# Altium project main board_Project.PrjPCB
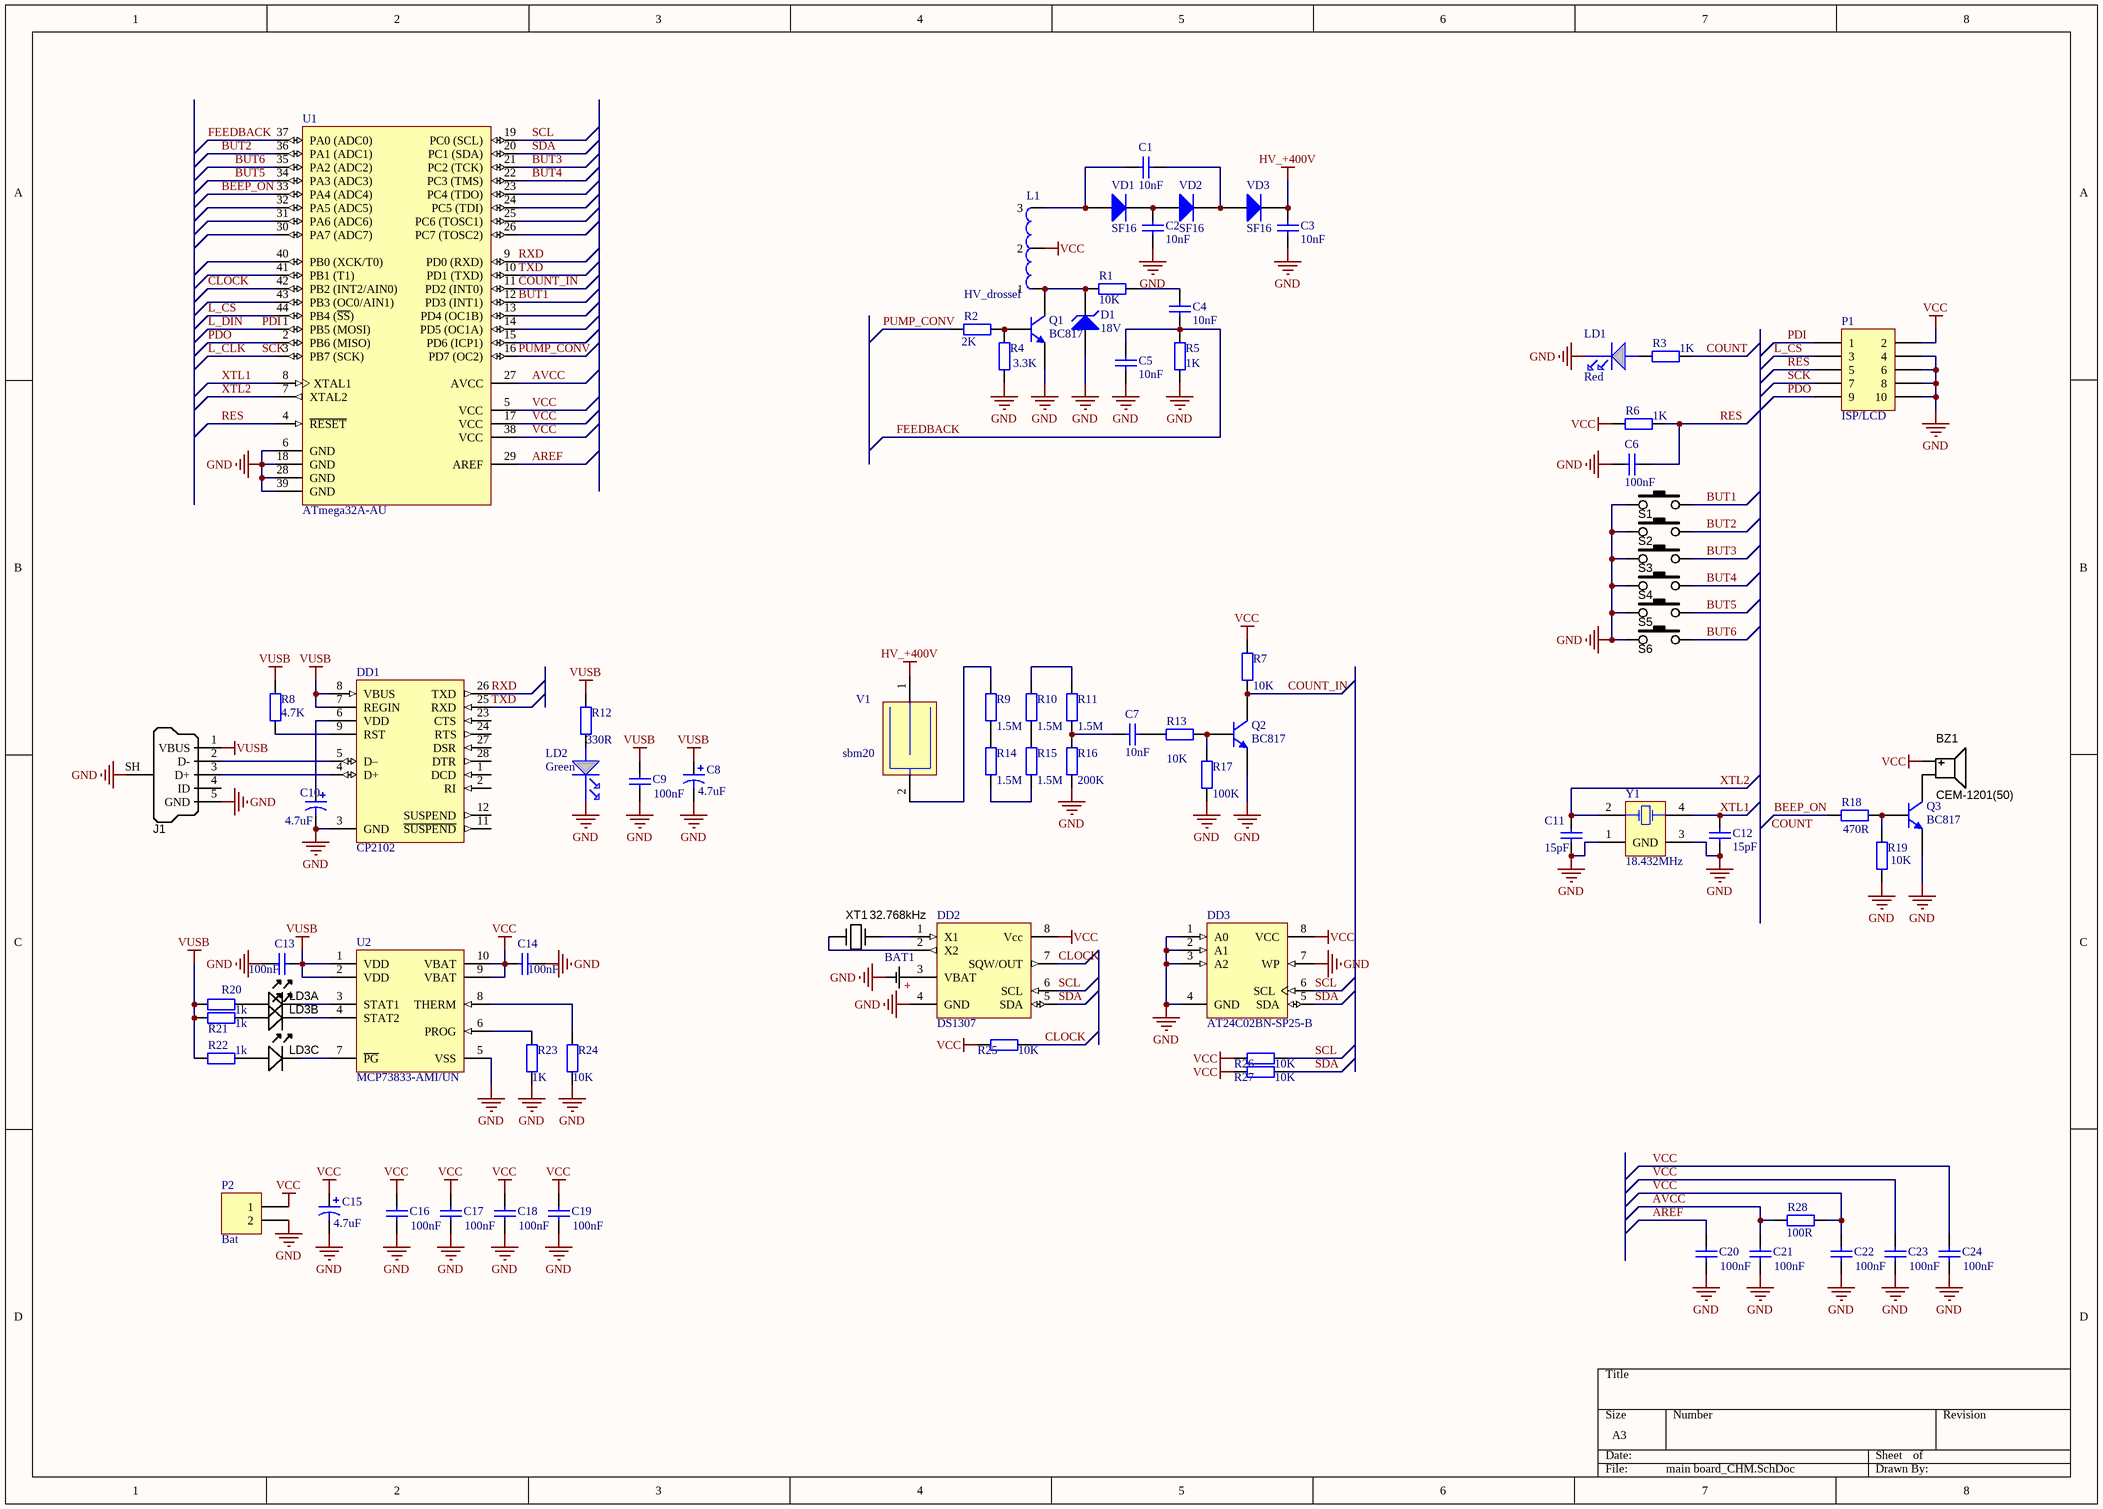
[diagram p0: main board_CHM.SchDoc]
1 sheet, 82 parts. Net scope: global (net labels, ports and power ports of the same name join across sheets).
Board file: main board_PCB.PcbDoc

## Sheet main board_CHM.SchDoc
size A3; PageSetup: Record=PageOptions|CenterHorizontal=True|CenterVertical=True|PrintScale=1.46|XCorrection=1.00|YCorrection=1.00|PrintKind=1|BorderSize=5000000|LeftOffset=0|BottomOffset=0|Orientation=2|PaperLength=5940|PaperWidth=4200|Scale=100|PaperSource=7|PrintQuality=600|MediaType=1|DitherType=10|PaperKind=A2|PrintScaleMode=1

### Parts
BAT1  CH23-1220LF  [CH23-1220LF]  (value not drawn)
BZ1  Manufacturer Part Number 1: CEM-1201(50)  [BUZZER_12.0X8.5MM]  (hidden comment: Alternate part: 3100-932)
C1  value 10nF  [CAPC3225X220N]  (hidden comment: C0805)
C2  value 10nF  [CAPC3225X220N]  (hidden comment: C0805)
C3  value 10nF  [CAPC3225X220N]  (hidden comment: C0805)
C4  value 10nF  [CAPC2012X135N]  (hidden comment: C0805)
C5  value 10nF  [CAPC2012X135N]  (hidden comment: C0805)
C6  value 100nF  [CAPC2012X135N]  (hidden comment: C0805)
C7  value 10nF  [CAPC2012X135N]  (hidden comment: C0805)
C8  value 4.7uF  [CAPMP3216X180N]  (hidden comment: Cap Pol1)
C9  value 100nF  [CAPC2012X135N]  (hidden comment: C0805)
C10  value 4.7uF  [CAPMP3216X180N]  (hidden comment: Cap Pol1)
C11  value 15pF  [CAPC2012X135N]  (hidden comment: C0805)
C12  value 15pF  [CAPC2012X135N]  (hidden comment: C0805)
C13  value 100nF  [CAPC2012X135N]  (hidden comment: C0805)
C14  value 100nF  [CAPC2012X135N]  (hidden comment: C0805)
C15  value 4.7uF  [CAPMP3216X180N]  (hidden comment: Cap Pol1)
C16  value 100nF  [CAPC2012X135N]  (hidden comment: C0805)
C17  value 100nF  [CAPC2012X135N]  (hidden comment: C0805)
C18  value 100nF  [CAPC2012X135N]  (hidden comment: C0805)
C19  value 100nF  [CAPC2012X135N]  (hidden comment: C0805)
C20  value 100nF  [CAPC2012X135N]  (hidden comment: C0805)
C21  value 100nF  [CAPC2012X135N]  (hidden comment: C0805)
C22  value 100nF  [CAPC2012X135N]  (hidden comment: C0805)
C23  value 100nF  [CAPC2012X135N]  (hidden comment: C0805)
C24  value 100nF  [CAPC2012X135N]  (hidden comment: C0805)
D1  18V  [DO-214AC]
DD1  CP2102  [32-QFN_M]
DD2  DS1307  [SOIC127P600X175-8AN]
DD3  AT24C02BN-SP25-B  [SOIC127P600X175-8AN]
J1  USB Micro Type B (recommended if hand soldering)  [USB_micro_VTN]  (value not drawn)
L1  HV_drossel  [HV_drossel]
LD1  value Red  [LED-0603-RED]  (hidden comment: PWR_H)
LD2  value Green  [LED-0603-GREEN]  (hidden comment: PWR_H)
LD3  Power status  [LED_3-HIGH_3MM]  (value not drawn)  (parts A,B,C of 3)
P1  ISP/LCD  [10P_PCB_HEADER_BRD_MNT]
P2  Bat  [HDR1X2]
Q1  BC817  [SOT23-3]
Q2  BC817  [SOT23-3]
Q3  BC817  [SOT23-3]
R1  value 10K  [RESC2012X70N]  (hidden comment: Res2)
R2  value 2K  [RESC2012X70N]  (hidden comment: Res2)
R3  value 1K  [RESC2012X70N]  (hidden comment: Res2)
R4  value 3.3K  [RESC2012X70N]  (hidden comment: Res2)
R5  value 1K  [RESC2012X70N]  (hidden comment: Res2)
R6  value 1K  [RESC2012X70N]  (hidden comment: Res2)
R7  value 10K  [RESC2012X70N]  (hidden comment: Res2)
R8  value 4.7K  [RESC2012X70N]  (hidden comment: Res2)
R9  value 1.5M  [RESC3216X70N]  (hidden comment: Res2)
R10  value 1.5M  [RESC3216X70N]  (hidden comment: Res2)
R11  value 1.5M  [RESC3216X70N]  (hidden comment: Res2)
R12  value 330R  [RESC2012X70N]  (hidden comment: Res2)
R13  value 10K  [RESC2012X70N]  (hidden comment: Res2)
R14  value 1.5M  [RESC3216X70N]  (hidden comment: Res2)
R15  value 1.5M  [RESC3216X70N]  (hidden comment: Res2)
R16  value 200K  [RESC3216X70N]  (hidden comment: Res2)
R17  value 100K  [RESC2012X70N]  (hidden comment: Res2)
R18  value 470R  [RESC2012X70N]  (hidden comment: Res2)
R19  value 10K  [RESC2012X70N]  (hidden comment: Res2)
R20  value 1k  [RESC2012X70N]  (hidden comment: Res2)
R21  value 1k  [RESC2012X70N]  (hidden comment: Res2)
R22  value 1k  [RESC2012X70N]  (hidden comment: Res2)
R23  value 1K  [RESC2012X70N]  (hidden comment: Res2)
R24  value 10K  [HDR1X2]  (hidden comment: Res2)
R25  value 10K  [6-0805_N]  (hidden comment: Res2)
R26  value 10K  [6-0805_N]  (hidden comment: Res2)
R27  value 10K  [6-0805_N]  (hidden comment: Res2)
R28  value 100R  [RESC2012X70N]  (hidden comment: Res2)
S1  SW_THT_PB_7.0mm  [KEY_L_F]  (value not drawn)
S2  SW_THT_PB_7.0mm  [KEY_L_F]  (value not drawn)
S3  SW_THT_PB_7.0mm  [KEY_L_F]  (value not drawn)
S4  SW_THT_PB_7.0mm  [KEY_L_F]  (value not drawn)
S5  SW_THT_PB_7.0mm  [KEY_L_F]  (value not drawn)
S6  SW_THT_PB_7.0mm  [KEY_L_F]  (value not drawn)
U1  ATmega32A-AU  [44A_N]
U2  MCP73833-AMI/UN  [MSOP-UN10_L]
V1  sbm20  [sbm20]
VD1  SF16  [DO-214AC]
VD2  SF16  [DO-214AC]
VD3  SF16  [DO-214AC]
XT1  32.768kHz  [CRYSTAL_CMR309T]
Y1  18.432MHz  [0532(MJ)]

### Nets
GND: BAT1.0 C2.2 C3.2 C5.2 C6.2 C8.2 C9.1 C10.2 C11.1 C12.1 C13.2 C14.1 C15.2 C16.1 C17.1 C18.1 C19.1 C20.1 C21.1 C22.1 C23.1 C24.1 D1.1(A) DD1.3(GND) DD2.4(GND) DD3.1(A0) DD3.2(A1) DD3.3(A2) DD3.4(GND) DD3.7(WP) J1.5(GND) J1.SH(Shell) LD1.K(CATODE) LD2.K(CATODE) P1.4 P1.6 P1.8 P1.10 P2.2 Q1.3(E) Q2.3(E) Q3.3(E) R4.1 R5.1 R16.1 R17.1 R19.1 R23.1 R24.1 S1.2 S2.2 S3.2 S4.2 S5.2 S6.2 U1.6(GND) U1.18(GND) U1.28(GND) U1.39(GND) U2.5(VSS) Y1.1(GND) Y1.3(GND)
HV_+400V: C3.1 V1.1 VD3.2(K)
VCC: BZ1.1(Positive) C14.2 C15.1 C16.2 C17.2 C18.2 C19.2 C22.2 C23.2 C24.2 DD2.8(Vcc) DD3.8(VCC) L1.2 P1.2 P2.1 R6.1 R7.2 R25.2 R26.2 R27.2 R28.2 U1.5(VCC) U1.17(VCC) U1.38(VCC) U2.9(VBAT) U2.10(VBAT)
VUSB: C8.1 C9.2 C13.1 DD1.7(REGIN) DD1.8(VBUS) J1.1(VBUS) R8.2 R12.2 R20.1 R21.1 R22.1 U2.1(VDD) U2.2(VDD)
AREF: C20.2 U1.29(AREF)
AVCC: C21.2 R28.1 U1.27(AVCC)
BEEP_ON: R3.2 R18.1 U1.33(PA4_(ADC4))  [also labelled COUNT]
BUT1: S1.1 U1.12(PD3_(INT1))
BUT2: S2.1 U1.36(PA1_(ADC1))
BUT3: S3.1 U1.21(PC2_(TCK))
BUT4: S4.1 U1.22(PC3_(TMS))
BUT5: S5.1 U1.34(PA3_(ADC3))
BUT6: S6.1 U1.35(PA2_(ADC2))
CLOCK: DD2.7(SQW/OUT) R25.1 U1.42(PB2_(INT2/AIN0))
COUNT_IN: Q2.1(C) R7.1 U1.11(PD2_(INT0))
FEEDBACK: C4.1 C5.1 R5.2 U1.37(PA0_(ADC0))
L_CLK: P1.7 U1.3(PB7_(SCK))  [also labelled SCK]
L_CS: P1.3 U1.44(PB4_(~{SS}))
L_DIN: P1.1 U1.1(PB5_(MOSI))  [also labelled PDI]
PDO: P1.9 U1.2(PB6_(MISO))
PUMP_CONV: R2.1 U1.16(PD7_(OC2))
RES: C6.1 P1.5 R6.2 U1.4(~{RESET})
RXD: DD1.26(TXD) U1.9(PD0_(RXD))
SCL: DD2.6(SCL) DD3.6(SCL) R26.1 U1.19(PC0_(SCL))
SDA: DD2.5(SDA) DD3.5(SDA) R27.1 U1.20(PC1_(SDA))
TXD: DD1.25(RXD) U1.10(PD1_(TXD))
XTL1: C12.2 U1.8(XTAL1) Y1.4(OSC2)
XTL2: C11.2 U1.7(XTAL2) Y1.2(OSC1)
NetBAT1_1: BAT1.1 DD2.3(VBAT)
NetBZ1_2: BZ1.2(Negative) Q3.1(C)
NetC1_1: C1.1 L1.3 VD1.1(A)
NetC1_2: C1.2 VD2.2(K) VD3.1(A)
NetC2_1: C2.1 VD1.2(K) VD2.1(A)
NetC4_2: C4.2 R1.1
NetC7_1: C7.1 R13.1
NetC7_2: C7.2 R11.1 R16.2
NetC10_1: C10.1 DD1.6(VDD)
NetD1_2: D1.2(K) L1.1 Q1.1(C) R1.2
NetDD1_4: DD1.4(D+) J1.3(D+)
NetDD1_5: DD1.5(D–) J1.2(D-)
NetDD1_9: DD1.9(RST) R8.1
NetDD2_1: DD2.1(X1) XT1.2(OUT)
NetDD2_2: DD2.2(X2) XT1.1(IN)
NetLD1_A: LD1.A(ANODE) R3.1
NetLD2_A: LD2.A(ANODE) R12.1
NetLD3_A1: LD3.A1 R20.2
NetLD3_A2: LD3.A2 R21.2
NetLD3_A3: LD3.A3 R22.2
NetLD3_K1: LD3.K1 U2.3(STAT1)
NetLD3_K2: LD3.K2 U2.4(STAT2)
NetLD3_K3: LD3.K3 U2.7(~{PG})
NetQ1_2: Q1.2(B) R2.2 R4.2
NetQ2_2: Q2.2(B) R13.2 R17.2
NetQ3_2: Q3.2(B) R18.2 R19.2
NetR9_1: R9.1 R14.2
NetR9_2: R9.2 V1.2
NetR10_1: R10.1 R15.2
NetR10_2: R10.2 R11.2
NetR14_1: R14.1 R15.1
NetR23_2: R23.2 U2.6(PROG)
NetR24_2: R24.2 U2.8(THERM)

Not connected (* = marked no-connect by the designer): DD1 1(DCD) 2(RI) 11(~{SUSPEND}) 12(SUSPEND) 23(CTS) 24(RTS) 27(DSR) 28(DTR); J1 4(ID); U1 13(PD4_(OC1B)) 14(PD5_(OC1A)) 15(PD6_(ICP1)) 23(PC4_(TDO)) 24(PC5_(TDI)) 25(PC6_(TOSC1)) 26(PC7_(TOSC2)) 30(PA7_(ADC7)) 31(PA6_(ADC6)) 32(PA5_(ADC5)) 40(PB0_(XCK/T0)) 41(PB1_(T1)) 43(PB3_(OC0/AIN1))

### Library data of the parts
BAT1 = CH23-1220LF: Battery holder
BZ1 = BZ_12x8.5x6.5_2kHz: Speaker, Magnetic Transducer; Manufacturer 1: CUI Inc; Ratings: 2048 ±200 Hz; SCDType: source; Package / Case: 6.5mm pitch; Material: Noryl SE1-J; Supplier 1: Digi-Key; Supplier Part Number 1: 102-1152-ND
C1-C7 C9 C11-C14 C16-C24 = C0805: Ceramic Chip Capacitor - Standard; Note: Footprint corresponds to dimensions for bulk cassette packaging. This case size has tightened tolerances.; Published: 17-Jul-2002; LatestRevisionDate: 19-Mar-2004; LatestRevisionNote: Silkscreen size reduced.; DatasheetDocument: Mar-2001; PackageDocument: Mar-2001; PackageReference: 0805; Publisher: Altium Limited; Code_JEITA: 0805; Code_IPC: 2012[0805]; ComponentLink1Description: Manufacturer Link; ComponentLink1URL: http://www.kemet.com/; ComponentLink2Description: Datasheet; ComponentLink2URL: http://www.kemet.com/kemet/web/homepage/kechome.nsf/vapubfilesname/F3102TA.pdf/$file/F3102TA.pdf
C8 C10 C15 = Cap Pol1: Polarized Capacitor (Radial); Published: 8-Jun-2000; LatestRevisionDate: 17-Jul-2002; LatestRevisionNote: Re-released for DXP Platform.; PackageReference: RB7.6-15; Publisher: Altium Limited; PackageDescription: Polarized Capacitor (Radial); 2 Leads
D1 = D Zener: Zener Diode; pin to pad: 1>A 2>K; Published: 8-Jun-2000; LatestRevisionDate: 17-Jul-2002; LatestRevisionNote: Re-released for DXP Platform.; PackageReference: DIODE-0.7; Publisher: Altium Limited; PackageDescription: Diode, Thru-Hole; 2 Leads; 0.7 in Pin Spacing
DD3 = AT24C02BN-SP25-B: 2Kbit (256 x 8), 2-wire Bus Automotive Serial EEPROM with full memory Write Protect, 2.5V, 8-Pin SOIC, Bulk; Published: 20-Sep-2010; DatasheetVersion: 8517C,  Jan-2009; PackageVersion: revC, Mar-2005; PackageReference: 8S1; Publisher: Altium Limited; PackageDescription: 8-Lead (0.150" Wide Body), Plastic Gull Wing Small Outline (JEDEC SOIC); Code_JEDEC: MS-012-AA; Code_IPC: SOIC127P600-8; ComponentLink1Description: Manufacturer Link; ComponentLink1URL: http://www.atmel.com/products/serial/default.asp; ComponentLink2Description: Datasheet; ComponentLink2URL: http://www.atmel.com/dyn/resources/prod_documents/doc8517.pdf; ComponentLink3Description: Atmel.com Home; ComponentLink3URL: http://www.atmel.com
J1 = USB_Micro_TypeB_FCI: Connector SMD-THD USB Micro Type B middle mount; Manufacturer 1: FCI; Manufacturer Part Number 1: 10103593-0001LF; SCDType: undef; Package / Case: SMD/THD mid-mount; Supplier 1: Digi-Key; Supplier Part Number 1: 609-4049-1-ND
LD1 LD2 = LED: APT1608QBC/D
LD3 = LEDPACK_GREEN_3HIGH_3MM: LED array PCB mount 3-high 3mm green; Manufacturer 1: Dialight; Manufacturer Part Number 1: 564-0100-222F; Ratings: 10mcd; 20mA; Voltge Rating: 2.1V; Wavelength - Peak: 585nm; Viewing Angle: 60°; SCDType: spec; Package / Case: 3-high LED bar; Supplier 1: Digi-Key; Supplier Part Number 1: 350-1752-ND; ComponentLink2URL: http://www.dialight.com/Assets/Brochures_And_Catalogs/Indication/564-0x00-xxx.pdf; ComponentLink2Description: http://www.dialight.com/Assets/Brochures_And_Catalogs/Indication/564-0x00-xxx.pdf; Color: Green; Value: Green
P1 = Header 5X2: Header, 5-Pin, Dual row; LatestRevisionDate: 17-Jul-2002; LatestRevisionNote: Re-released for DXP Platform.; Publisher: Altium Limited
P2 = Header 2: Header, 2-Pin; LatestRevisionDate: 17-Jul-2002; LatestRevisionNote: Re-released for DXP Platform.; Publisher: Altium Limited
Q1-Q3 = QNPN: NPN Bipolar Transistor; pin to pad: 1>3 2>1 3>2; Published: 8-Jun-2000; LatestRevisionDate: 29-May-2009; LatestRevisionNote: IPC-7351 Footprint Added.; PackageVersion: Aug-1999; PackageReference: SOT-23B; Publisher: Altium Limited; PackageDescription: 3-Pin SOT-23 Package 0.95 mm Pitch, 2.4 mm Lead Span
R1-R28 = Res2: Resistor; Published: 8-Jun-2000; LatestRevisionDate: 17-Jul-2002; LatestRevisionNote: Re-released for DXP Platform.; PackageReference: AXIAL-0.4; Publisher: Altium Limited; PackageDescription: Axial Device, Thru-Hole; 2 Leads; 0.4 in Pin Spacing
S1-S6 = SW_THT_PB_7.0mm: Switch, tact, 7.0mm stem; Manufacturer 1: Bond-Tact; Manufacturer Part Number 1: TS-1170-WP-300; SCDType: source*; Function: On/Off; Package / Case: 6.5x6.5mm; 7.0mm stem; Material: Brass/Nylon/Ag plating
U1 = ATmega32A-AU: 8-bit AVR Microcontroller, 32KB Flash, 1KB EEPROM, 2KB SRAM, 44-pin TQFP, Industrial Grade (-40°C to 85°C); Published: 1-Apr-2010; DatasheetVersion: revB, Jul-2009; PackageVersion: rev.B, Oct-2001; PackageReference: 44A; Publisher: Altium Limited; PackageDescription: 44-Pin Plastic Thin Profile Quad Flat Pack, 10 x 10 x 1.0 mm Body, 0.8 mm Pitch (TQFP); Supplier 1: Digi-Key; Supplier Part Number 1: ATMEGA32A-AU-ND; Supplier 2: Farnell; Supplier Part Number 2: 1704563; Supplier 3: Mouser; Supplier Part Number 3: 556-ATMEGA32A-AU; ComponentLink1Description: Manufacturer Link; ComponentLink1URL: http://www.atmel.com/products/avr/default.asp?; ComponentLink2Description: ATmega32A Datasheet; ComponentLink2URL: http://www.atmel.com/dyn/resources/prod_documents/doc8155.pdf; ComponentLink3Description: ATmega32A Summary; ComponentLink3URL: http://www.atmel.com/dyn/resources/prod_documents/8155S.pdf; ComponentLink4Description: Atmel.com Home; ComponentLink4URL: http://www.atmel.com
U2 = MCP73833-AMI/UN: Stand-Alone Linear Li-Ion/Li-Polymer Charge Management Controller with Power-Good Output, 4.2V, 10-Pin MSOP, Industrial Temperature; Published: 29-Jan-2009; LatestRevisionDate: 27-Nov-2009; LatestRevisionNote: Updated to datasheet revision B, May-2009; DatasheetVersion: revB, May-2009; PackageVersion: revBB, Aug-2009; PackageReference: MSOP-UN10; Publisher: Altium Limited; PackageDescription: 10-Lead Plastic Micro Small Outline Package (UN) [MSOP]; Supplier 1: Digi-Key; Supplier Part Number 1: MCP73833-AMI/UN-ND; Supplier 2: Farnell; Supplier Part Number 2: 1332160; ComponentLink1Description: Datasheet; ComponentLink1URL: http://ww1.microchip.com/downloads/en/DeviceDoc/22005b.pdf; ComponentLink2Description: Packaging Specification; ComponentLink2URL: http://www.microchip.com/stellent/groups/techpub_sg/documents/packagingspec/en012702.pdf; ComponentLink3Description: Microchip.com Home; ComponentLink3URL: http://www.microchip.com/
V1 = K1.1
VD1-VD3 = Diode 1N4001: 1 Amp General Purpose Rectifier; pin to pad: 1>A 2>K; Published: 8-Jun-2000; LatestRevisionDate: 17-Jul-2002; LatestRevisionNote: Re-released for DXP Platform.; DatasheetVersion: 1998; PackageVersion: Aug-1999; PackageReference: DO-41; Publisher: Altium Limited; PackageDescription: Diode, Axial; Body 5.2 x 2.7 mm (LxDia. max), Lead Dia. 0.86 mm (max); Code_JEDEC: DO-204-AL; ComponentLink1Description: Manufacturer Link; ComponentLink1URL: http://www.fairchildsemi.com/; ComponentLink2Description: Datasheet; ComponentLink2URL: http://www.fairchildsemi.com/ds/1N%2F1N4001.pdf
XT1 = Crystal_6MHz_CMR309T: Resonator Ceramic 6.00 MHz 30ppm; Manufacturer 1: Citizen Finetech Miyota; Manufacturer Part Number 1: CMR309T-6.000MABJ-UT; Frequency: 6MHz; Frequency Stability: ±50ppm; Load Capacitance: 18pF; Operating Mode: Fundamental; SCDType: spec; Package / Case: Cylindrical Can, Radial; Ratings: 6.00 MHz; Type: MHz Crystal; Frequency Tolerance: ±30ppm; Operating Temperature: -10°C ~ 60°C; Mounting Type: Surface Mount; Size / Dimension: 0.118" Dia x 0.346" L (3.00mm x 8.80mm); Height: 0.122" (3.10mm); Supplier 1: Digi-Key; Supplier Part Number 1: 300-8348-1-ND; Tolerance: ±50ppm; ComponentLink1URL: http://media.digikey.com/pdf/Data%20Sheets/Citizen%20PDFs/CMR310T%20CMR309T.pdf; ComponentLink1Description: http://media.digikey.com/pdf/Data%20Sheets/Citizen%20PDFs/CMR310T%20CMR309T.pdf; Value: 32.768kHz
Y1 = Y_0532(MJ): Crystal Oscillator; Value: 18.432MHz